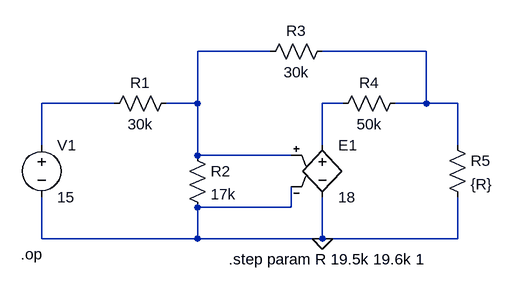
[diagram p0: schematic question2.asc]
question2.asc, the LTspice schematic file:
Version 4
SHEET 1 880 680
WIRE 304 48 192 48
WIRE 544 48 384 48
WIRE 64 128 -48 128
WIRE 192 128 192 48
WIRE 192 128 144 128
WIRE 416 128 384 128
WIRE 544 128 544 48
WIRE 544 128 496 128
WIRE 592 128 544 128
WIRE -48 192 -48 128
WIRE 384 192 384 128
WIRE 592 192 592 128
WIRE 192 208 192 128
WIRE 336 208 192 208
WIRE 336 288 336 256
WIRE 336 288 192 288
WIRE -48 336 -48 272
WIRE 192 336 192 288
WIRE 192 336 -48 336
WIRE 384 336 384 272
WIRE 384 336 192 336
WIRE 592 336 592 272
WIRE 592 336 384 336
FLAG 384 336 0
SYMBOL res 288 64 R270
WINDOW 0 32 56 VTop 2
WINDOW 3 0 56 VBottom 2
SYMATTR InstName R3
SYMATTR Value 30k
SYMBOL res 400 144 R270
WINDOW 0 32 56 VTop 2
WINDOW 3 0 56 VBottom 2
SYMATTR InstName R4
SYMATTR Value 50k
SYMBOL res 176 192 R0
SYMATTR InstName R2
SYMATTR Value 17k
SYMBOL e 384 176 R0
SYMATTR InstName E1
SYMATTR Value 18
SYMBOL res 48 144 R270
WINDOW 0 32 56 VTop 2
WINDOW 3 0 56 VBottom 2
SYMATTR InstName R1
SYMATTR Value 30k
SYMBOL voltage -48 176 R0
WINDOW 123 0 0 Left 0
WINDOW 39 0 0 Left 0
SYMATTR InstName V1
SYMATTR Value 15
SYMBOL res 576 176 R0
SYMATTR InstName R5
SYMATTR Value {R}
TEXT -80 360 Left 2 !.op
TEXT 240 368 Left 2 !.step param R 19.5k 19.6k 1

The netlist it stands for:
* question2.asc
R3 N001 N002 30k
R4 N004 N002 50k
R2 N001 0 17k
E1 N004 0 N001 0 18
R1 N003 N001 30k
V1 N003 0 15
R5 N002 0 {R}
.op
.step param R 19.5k 19.6k 1
.backanno
.end